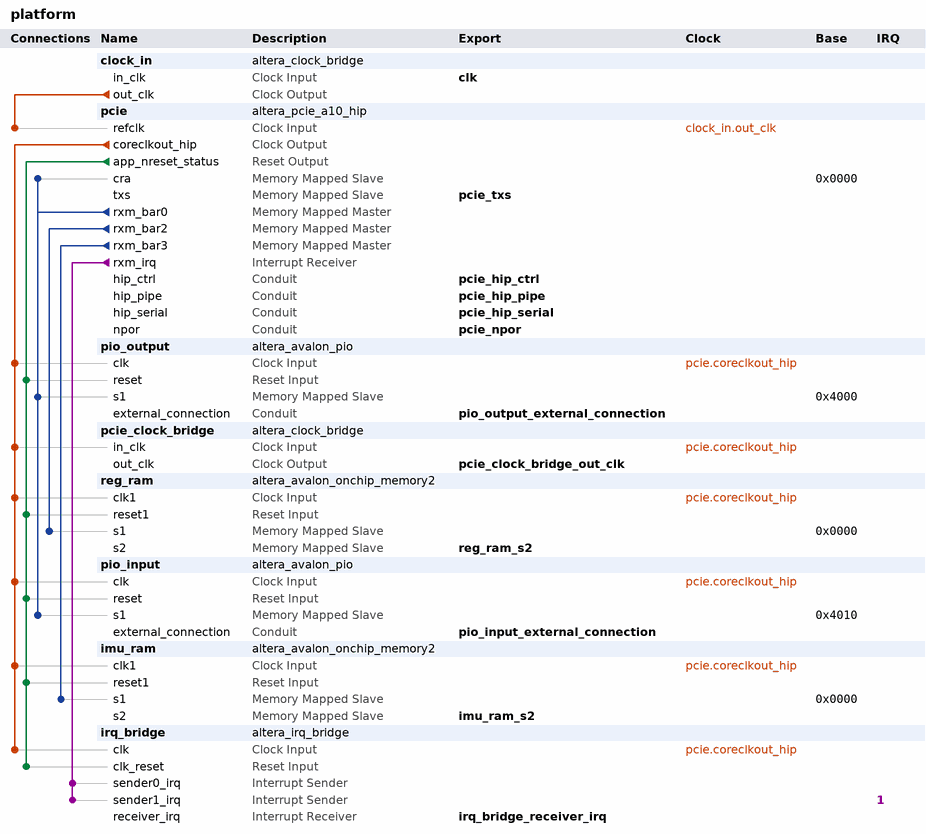
[diagram p0: system contents]
# Platform Designer (Qsys) system platform, Cyclone 10 GX 10CX220YF672E6G
# Parameters at their usual value, and those the tool derives, are not listed.
package require -exact qsys 1.0
create_system platform
set_project_property DEVICE_FAMILY {Cyclone 10 GX}
set_project_property DEVICE 10CX220YF672E6G

add_component clock_in platform_clock_in.ip altera_clock_bridge clock_in 18.0

add_component pcie pcie.ip altera_pcie_a10_hip pcie 18.0

add_component pio_output pio_output.ip altera_avalon_pio pio_output 18.0

add_component pcie_clock_bridge pcie_clock_bridge.ip altera_clock_bridge pcie_clock_bridge 18.0

add_component reg_ram reg_ram.ip altera_avalon_onchip_memory2 reg_ram 18.0

add_component pio_input pio_input.ip altera_avalon_pio pio_input 18.0

add_component imu_ram imu_ram.ip altera_avalon_onchip_memory2 imu_ram 18.0

add_component irq_bridge irq_bridge.ip altera_irq_bridge irq_bridge 18.0

# connections
add_connection clock_in.out_clk pcie.refclk clock
add_connection pcie.coreclkout_hip imu_ram.clk1 clock
add_connection pcie.coreclkout_hip irq_bridge.clk clock
add_connection pcie.coreclkout_hip pcie_clock_bridge.in_clk clock
add_connection pcie.coreclkout_hip pio_input.clk clock
add_connection pcie.coreclkout_hip pio_output.clk clock
add_connection pcie.coreclkout_hip reg_ram.clk1 clock
add_connection pcie.app_nreset_status imu_ram.reset1 reset
add_connection pcie.app_nreset_status irq_bridge.clk_reset reset
add_connection pcie.app_nreset_status pio_input.reset reset
add_connection pcie.app_nreset_status pio_output.reset reset
add_connection pcie.app_nreset_status reg_ram.reset1 reset
add_connection pcie.rxm_bar0 pcie.cra avalon
set_connection_parameter_value pcie.rxm_bar0/pcie.cra baseAddress 0x0000
add_connection pcie.rxm_bar0 pio_input.s1 avalon
set_connection_parameter_value pcie.rxm_bar0/pio_input.s1 baseAddress 0x4010
add_connection pcie.rxm_bar0 pio_output.s1 avalon
set_connection_parameter_value pcie.rxm_bar0/pio_output.s1 baseAddress 0x4000
add_connection pcie.rxm_bar2 reg_ram.s1 avalon
set_connection_parameter_value pcie.rxm_bar2/reg_ram.s1 baseAddress 0x0000
add_connection pcie.rxm_bar3 imu_ram.s1 avalon
set_connection_parameter_value pcie.rxm_bar3/imu_ram.s1 baseAddress 0x0000
add_connection pcie.rxm_irq irq_bridge.sender0_irq interrupt
add_connection pcie.rxm_irq irq_bridge.sender1_irq interrupt
set_connection_parameter_value pcie.rxm_irq/irq_bridge.sender1_irq irqNumber 1

# exported interfaces
add_interface clk clock sink
set_interface_property clk EXPORT_OF clock_in.in_clk
add_interface imu_ram_s2 avalon slave
set_interface_property imu_ram_s2 EXPORT_OF imu_ram.s2
add_interface irq_bridge_receiver_irq interrupt receiver
set_interface_property irq_bridge_receiver_irq EXPORT_OF irq_bridge.receiver_irq
add_interface pcie_clock_bridge_out_clk clock source
set_interface_property pcie_clock_bridge_out_clk EXPORT_OF pcie_clock_bridge.out_clk
add_interface pcie_hip_ctrl conduit end
set_interface_property pcie_hip_ctrl EXPORT_OF pcie.hip_ctrl
add_interface pcie_hip_pipe conduit end
set_interface_property pcie_hip_pipe EXPORT_OF pcie.hip_pipe
add_interface pcie_hip_serial conduit end
set_interface_property pcie_hip_serial EXPORT_OF pcie.hip_serial
add_interface pcie_npor conduit end
set_interface_property pcie_npor EXPORT_OF pcie.npor
add_interface pcie_txs avalon slave
set_interface_property pcie_txs EXPORT_OF pcie.txs
add_interface pio_input_external_connection conduit end
set_interface_property pio_input_external_connection EXPORT_OF pio_input.external_connection
add_interface pio_output_external_connection conduit end
set_interface_property pio_output_external_connection EXPORT_OF pio_output.external_connection
add_interface reg_ram_s2 avalon slave
set_interface_property reg_ram_s2 EXPORT_OF reg_ram.s2

set_interconnect_requirement {$system} qsys_mm.clockCrossingAdapter HANDSHAKE
set_interconnect_requirement {$system} qsys_mm.enableEccProtection FALSE
set_interconnect_requirement {$system} qsys_mm.insertDefaultSlave FALSE
set_interconnect_requirement {$system} qsys_mm.maxAdditionalLatency 1

save_system platform.qsys
